# EAGLE design pcinterface-light (EAGLE 6.3)
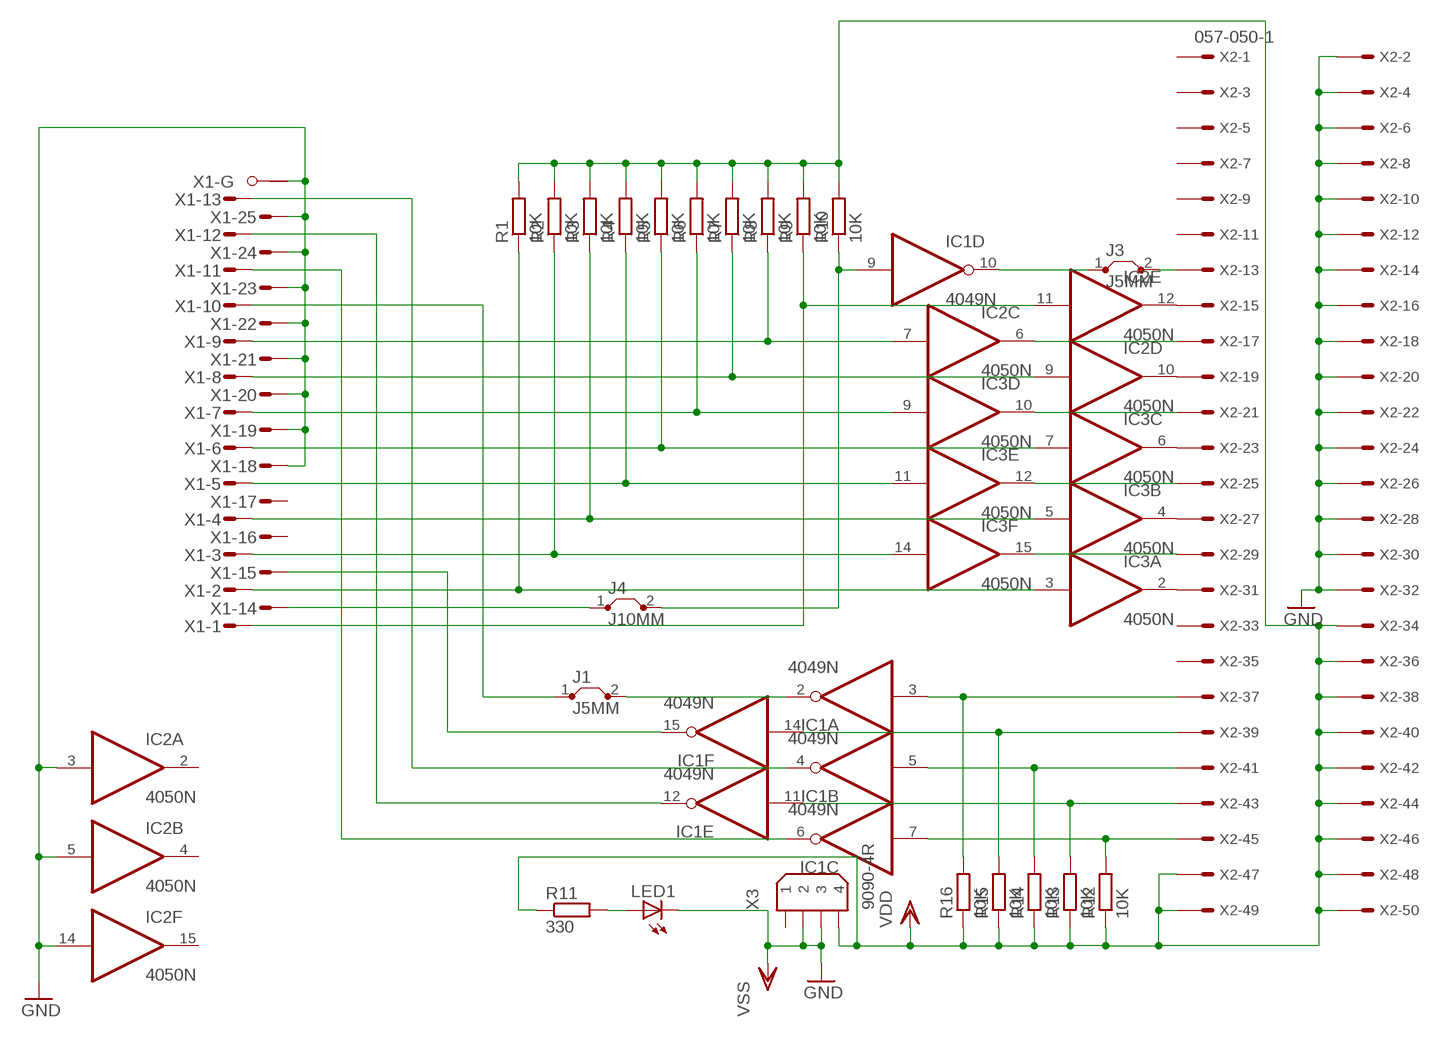
[diagram p0: schematic, sheet 1]

## Parts
IC1  4049N  [DIL16]
IC2  4050N  [DIL16]
IC3  4050N  [DIL16]
J1  J5MM  [05]
J3  J5MM  [05]
J4  J10MM  [10]
LED1  LED3MM  [LED3MM]
R1  10K  R-EU_0207/10  [0207/10]
R2  10K  R-EU_0207/10  [0207/10]
R3  10K  R-EU_0207/10  [0207/10]
R4  10K  R-EU_0207/10  [0207/10]
R5  10K  R-EU_0207/10  [0207/10]
R6  10K  R-EU_0207/10  [0207/10]
R7  10K  R-EU_0207/10  [0207/10]
R8  10K  R-EU_0207/10  [0207/10]
R9  10K  R-EU_0207/10  [0207/10]
R10  10K  R-EU_0207/10  [0207/10]
R11  330  R-EU_0207/10  [0207/10]
R12  10K  R-EU_0207/10  [0207/10]
R13  10K  R-EU_0207/10  [0207/10]
R14  10K  R-EU_0207/10  [0207/10]
R15  10K  R-EU_0207/10  [0207/10]
R16  10K  R-EU_0207/10  [0207/10]
X1  M25HPS  [M25HP]
X2  057-050-1  [057-050-1]
X3  9090-4R  [9090-4R]

## Nets
N$1: J4.1 X1.14(-14:M)
N$2: LED1.A R11.2
N$3: IC2.12(E:O) X2.15
N$4: IC2.6(C:O) X2.17
N$5: IC2.10(D:O) X2.19
N$6: IC3.10(D:O) X2.21
N$7: IC3.6(C:O) X2.23
N$8: IC3.12(E:O) X2.25
N$9: IC3.4(B:O) X2.27
N$10: IC3.15(F:O) X2.29
N$11: IC3.2(A:O) X2.31
N$12: IC1.9(D:I) J4.2 R10.1
N$13: IC2.11(E:I) R9.1 X1.1(-1:M)
N$14: IC2.7(C:I) R8.1 X1.9(-9:M)
N$15: IC2.9(D:I) R7.1 X1.8(-8:M)
N$16: IC3.9(D:I) R6.1 X1.7(-7:M)
N$17: IC3.7(C:I) R5.1 X1.6(-6:M)
N$18: IC3.11(E:I) R4.1 X1.5(-5:M)
N$19: IC3.5(B:I) R3.1 X1.4(-4:M)
N$20: IC3.14(F:I) R2.1 X1.3(-3:M)
N$21: IC3.3(A:I) R1.1 X1.2(-2:M)
N$22: IC1.7(C:I) R12.2 X2.45
N$23: IC1.11(E:I) R13.2 X2.43
N$24: IC1.5(B:I) R14.2 X2.41
N$25: IC1.14(F:I) R15.2 X2.39
N$26: IC1.3(A:I) R16.2 X2.37
N$28: IC1.6(C:O) X1.11(-11:M)
N$29: IC1.12(E:O) X1.12(-12:M)
N$30: IC1.4(B:O) X1.13(-13:M)
N$31: IC1.15(F:O) X1.15(-15:M)
N$32: J1.1 X1.10(-10:M)
N$34: IC1.2(A:O) J1.2
N$35: IC1.10(D:O) J3.1
N$36: J3.2 X2.13
VDD: R1.2 R2.2 R3.2 R4.2 R5.2 R6.2 R7.2 R8.2 R9.2 R10.2 R11.1 R12.1 R13.1 R14.1 R15.1 R16.1 X2.34 X2.36 X2.38 X2.40 X2.42 X2.44 X2.46 X2.47 X2.48 X2.49 X2.50 X3.4
VSS: IC2.3(A:I) IC2.5(B:I) IC2.14(F:I) LED1.K(C) X1.18(-18:M) X1.19(-19:M) X1.20(-20:M) X1.21(-21:M) X1.22(-22:M) X1.23(-23:M) X1.24(-24:M) X1.25(-25:M) X1.G1(-G:G1) X2.2 X2.4 X2.6 X2.8 X2.10 X2.12 X2.14 X2.16 X2.18 X2.20 X2.22 X2.24 X2.26 X2.28 X2.30 X2.32 X3.2 X3.3 ; supply symbol labelled GND
Unconnected: IC2.2(A:O) IC2.4(B:O) IC2.15(F:O) X1.16(-16:M) X1.17(-17:M) X1.G2(-G:G2) X2.1 X2.3 X2.5 X2.7 X2.9 X2.11 X2.33 X2.35 X3.1

## Power pins joined to a net without a drawn wire
VDD: IC1.1(P:VDD) IC2.1(P:VDD) IC3.1(P:VDD)
VSS: IC1.8(P:VSS) IC2.8(P:VSS) IC3.8(P:VSS)

## Library data of the parts
IC1 = 40xx:4049: Hex inverting BUFFER
IC2 IC3 = 40xx:4050: Hex non-inverting BUFFER
J1 J3 J4 = jumper:J: Bridge
LED1 = led:LED: LED OSRAM: - CHIPLED LG R971, LG N971, LY N971, LG Q971, LY Q971, LO R971, LY R971 LH N974, LH R974 LS Q976, LO Q976, LY Q976 LO Q996 - Hyper CHIPLED LW Q18S LB Q993, LB Q99A, LB R99A - SideLED LS A670, LO A670, LY A670, LG A670, LP A670 LB A673, LV A673, LT A673, LW A673 LH A674 LY A675 LS A676, LA A676, LO A676, LY A676, LW A676 LS A679, LY A679, LG A679 - Hyper Micro SIDELED® LS Y876, LA Y876, LO Y876, LY Y876 LT Y87S - SmartLED LW L88C, LW L88S LB L89C, LB L89S, LG L890 LS L89K, LO L89K, LY L89K LS L896, LA L896, LO L896, LY L896 - TOPLED LS T670, LO T670, LY T670, LG T670, LP T670 LSG T670, LSP T670, LSY T670, LOP T670, LYG T670 LG T671, LOG T671, LSG T671 LB T673, LV T673, LT T673, LW T673 LH T674 LS T676, LA T676, LO T676, LY T676, LB T676, LH T676, LSB T676, LW T676 LB T67C, LV T67C, LT T67C, LS T67K, LO T67K, LY T67K, LW E67C LS E67B, LA E67B, LO E67B, LY E67B, LB E67C, LV E67C, LT E67C LW T67C LS T679, LY T679, LG T679 LS T770, LO T770, LY T770, LG T770, LP T770 LB T773, LV T773, LT T773, LW T773 LH T774 LS E675, LA E675, LY E675, LS T675 LS T776, LA T776, LO T776, LY T776, LB T776 LHGB T686 LT T68C, LB T68C - Hyper Mini TOPLED® LB M676 - Mini TOPLED Santana® LG M470 LS M47K, LO M47K, LY M47K Source: http://www.osram.convergy.de LUXEON: - LUMILED® LXK2-PW12-R00, LXK2-PW12-S00, LXK2-PW14-U00, LXK2-PW14-V00 LXK2-PM12-R00, LXK2-PM12-S00, LXK2-PM14-U00 LXK2-PE12-Q00, LXK2-PE12-R00, LXK2-PE12-S00, LXK2-PE14-T00, LXK2-PE14-U00 LXK2-PB12-K00, LXK2-PB12-L00, LXK2-PB12-M00, LXK2-PB14-N00, LXK2-PB14-P00, LXK2-PB14-Q00 LXK2-PR12-L00, LXK2-PR12-M00, LXK2-PR14-Q00, LXK2-PR14-R00 LXK2-PD12-Q00, LXK2-PD12-R00, LXK2-PD12-S00 LXK2-PH12-R00, LXK2-PH12-S00 LXK2-PL12-P00, LXK2-PL12-Q00, LXK2-PL12-R00 Source: www.luxeon.com KINGBRIGHT: KA-3528ASYC Source: www.kingbright.com
R1-R16 = resistor:R-EU_: RESISTOR, European symbol
X1 = con-subd:M25HPS: SUB-D; OC_FARNELL: unknown; OC_NEWARK: unknown
X2 = con-panduit:057-050-: CONNECTOR 50-pin series 057 contact pc board low profile headers; OC_FARNELL: unknown; OC_NEWARK: unknown
X3 = con-thomas-betts:9090-4: Disk Drive Power four position Source: Thomas & Betts Electronic Interconnects Eiropean Edition 1998; OC_FARNELL: unknown; OC_NEWARK: unknown

## Board
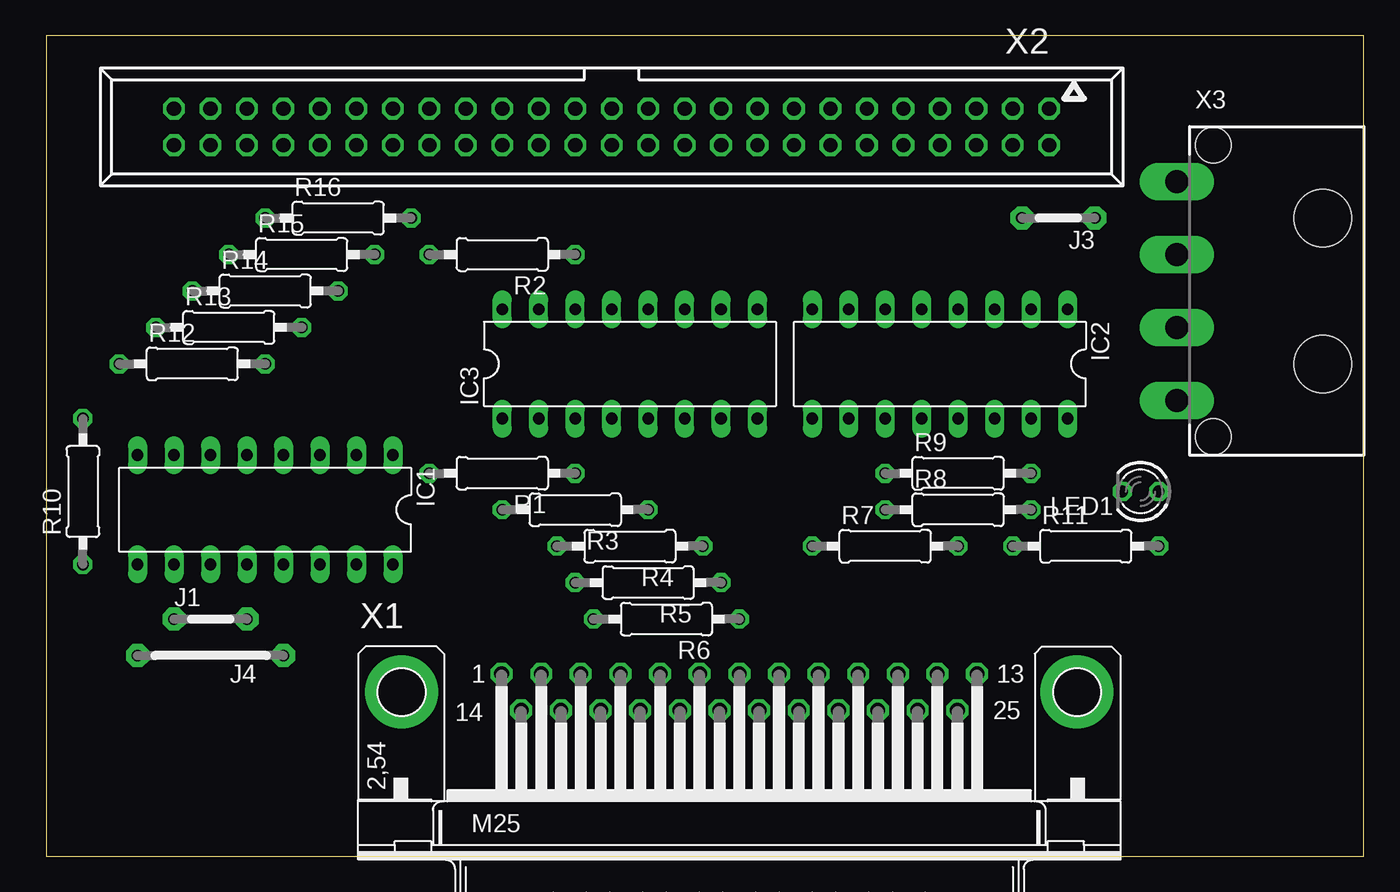
[diagram p1: board, top side]
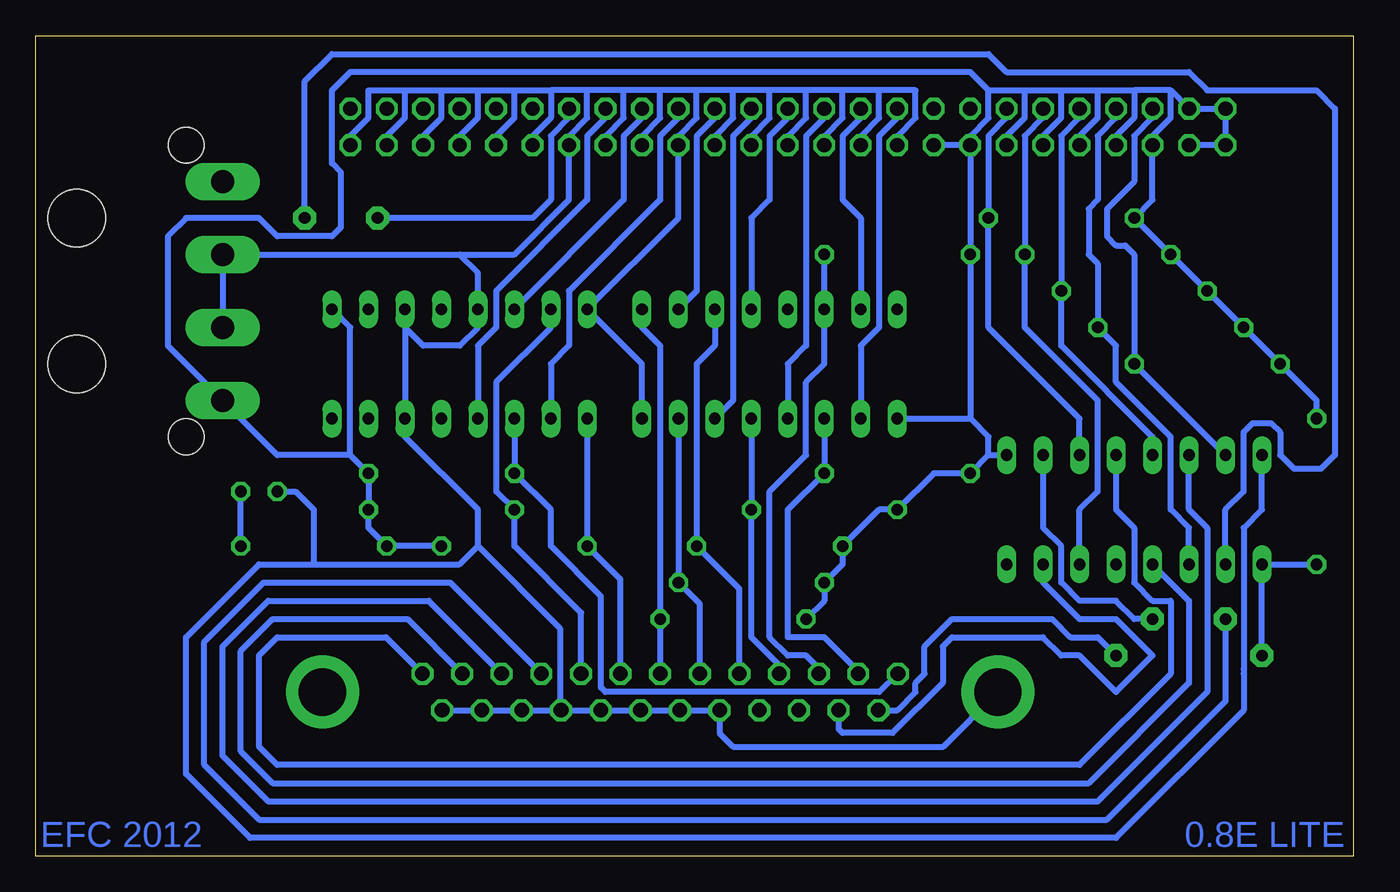
[diagram p2: board, bottom side, seen from below]

Size 91.75 x 57.14 mm. Coordinates in mm from the lower left corner, seen from the top.
Outline: 0,0 91.75,0 91.75,57.14 0,57.14 0,0
Copper layers (1*16): Top 0.035mm / dielectric 1.5mm / Bottom 0.035mm
Design rules "default": minimum track width 10mil, minimum drill 24mil, track to track 8mil, track to pad 8mil, pad to pad 8mil, via to via 8mil, smd to smd 8mil, copper to edge 40mil, drill to drill 8mil, minimum pad ring 10mil, minimum via ring 8mil, stop-mask expansion 4mil, vias tented up to drill 0mil, thermal gap 10mil

### Footprints (pad centres in the part's own frame; a part is rotated, then mirrored left to right if it is on the bottom)
DIL16 = drill 0.813 long: 1 -8.89,-3.81; 2 -6.35,-3.81; 3 -3.81,-3.81; 4 -1.27,-3.81; 5 1.27,-3.81; 6 3.81,-3.81; 7 6.35,-3.81; 8 8.89,-3.81; 9 8.89,3.81; 10 6.35,3.81; 11 3.81,3.81; 12 1.27,3.81; 13 -1.27,3.81; 14 -3.81,3.81; 15 -6.35,3.81; 16 -8.89,3.81
05 = drill 0.813 pad 1.6 octagon: 1 -2.54,0; 2 2.54,0
10 = drill 0.813 pad 1.6 octagon: 1 -5.08,0; 2 5.08,0
LED3MM = drill 0.813 octagon: A -1.27,0; K 1.27,0
0207/10 = drill 0.813 octagon: 1 -5.08,0; 2 5.08,0
M25HP = drill 1.016 octagon: 1 -16.561,1.27; 2 -13.792,1.27; 3 -11.049,1.27; 4 -8.28,1.27; 5 -5.512,1.27; 6 -2.769,1.27; 7 0,1.27; 8 2.769,1.27; 9 5.512,1.27; 10 8.28,1.27; 11 11.049,1.27; 12 13.792,1.27; 13 16.561,1.27; 14 -15.189,-1.27; 15 -12.421,-1.27; 16 -9.652,-1.27; 17 -6.909,-1.27; 18 -4.14,-1.27; 19 -1.372,-1.27; 20 1.372,-1.27; 21 4.14,-1.27; 22 6.909,-1.27; 23 9.652,-1.27; 24 12.421,-1.27; 25 15.189,-1.27 | drill 3.302 pad 5.08: G1 -23.52,0; G2 23.52,0
057-050-1 = drill 1 octagon: 1 -30.48,-1.27; 2 -30.48,1.27; 3 -27.94,-1.27; 4 -27.94,1.27; 5 -25.4,-1.27; 6 -25.4,1.27; 7 -22.86,-1.27; 8 -22.86,1.27; 9 -20.32,-1.27; 10 -20.32,1.27; 11 -17.78,-1.27; 12 -17.78,1.27; 13 -15.24,-1.27; 14 -15.24,1.27; 15 -12.7,-1.27; 16 -12.7,1.27; 17 -10.16,-1.27; 18 -10.16,1.27; 19 -7.62,-1.27; 20 -7.62,1.27; 21 -5.08,-1.27; 22 -5.08,1.27; 23 -2.54,-1.27; 24 -2.54,1.27; 25 0,-1.27; 26 0,1.27; 27 2.54,-1.27; 28 2.54,1.27; 29 5.08,-1.27; 30 5.08,1.27; 31 7.62,-1.27; 32 7.62,1.27; 33 10.16,-1.27; 34 10.16,1.27; 35 12.7,-1.27; 36 12.7,1.27; 37 15.24,-1.27; 38 15.24,1.27; 39 17.78,-1.27; 40 17.78,1.27; 41 20.32,-1.27; 42 20.32,1.27; 43 22.86,-1.27; 44 22.86,1.27; 45 25.4,-1.27; 46 25.4,1.27; 47 27.94,-1.27; 48 27.94,1.27; 49 30.48,-1.27; 50 30.48,1.27
9090-4R = drill 1.6 pad 2.6 long: 1 -7.62,-6.35; 2 -2.54,-6.35; 3 2.54,-6.35; 4 7.62,-6.35 | hole 4: -5.08,3.81; 5.08,3.81 | hole 2.5: -10.16,-3.81; 10.16,-3.81

### Placement (x,y rotation side)
IC1  15.24,24.13 180 top
IC2  62.23,34.29 180 top
IC3  40.64,34.29 0 top
J1  11.43,16.51 0 top
J3  70.48,44.45 180 top
J4  11.43,13.97 180 top
LED1  76.2,25.4 180 top
R1  31.75,26.67 180 top
R2  31.75,41.91 180 top
R3  36.83,24.13 180 top
R4  40.64,21.59 180 top
R5  41.91,19.05 180 top
R6  43.18,16.51 180 top
R7  58.42,21.59 0 top
R8  63.5,24.13 0 top
R9  63.5,26.67 0 top
R10  2.54,25.4 90 top
R11  72.39,21.59 0 top
R12  10.16,34.29 0 top
R13  12.7,36.83 0 top
R14  15.24,39.37 0 top
R15  17.78,41.91 0 top
R16  20.32,44.45 0 top
X1  48.26,11.43 0 top
X2  39.37,50.8 180 top
X3  85.09,39.37 270 top

### Tracks (layer width: path | path; a pad name or v marks a point on that pad's centre or on a via)
N$1
  Bottom 0.406: X1.14 31.75,10.16 30.48,11.43 30.48,12.06 29.84,12.7 29.84,14.61 27.94,16.51 20.95,16.51 19.69,15.24 17.78,15.24 J4.1
N$2
  Bottom 0.406: R11.2 LED1.A
N$3
  Bottom 0.406: X2.15 52.07,51.44 53.34,50.17 53.34,45.72 59.69,39.37 59.69,36.83 60.96,35.56 IC2.12
N$4
  Bottom 0.406: X2.17 49.53,51.44 50.8,50.17 50.8,45.72 IC2.6
N$5
  Bottom 0.406: X2.19 46.99,51.44 48.26,50.17 48.26,45.72 54.61,39.37 54.61,35.56 55.88,34.29 IC2.10
N$6
  Bottom 0.406: X2.21 44.45,51.44 45.72,50.17 45.72,39.37 IC3.10
N$7
  Bottom 0.406: X2.23 41.91,51.44 43.18,50.17 43.18,31.75 IC3.6
N$8
  Bottom 0.406: X2.25 39.37,51.44 40.64,50.17 40.64,45.72 41.91,44.45 IC3.12
N$9
  Bottom 0.406: X2.27 36.83,51.44 38.1,50.17 38.1,35.56 39.37,34.29 IC3.4
N$10
  Bottom 0.406: X2.29 34.29,51.44 35.56,50.17 35.56,45.72 34.29,44.45 IC3.15
N$11
  Bottom 0.406: X2.31 31.75,51.44 33.02,50.17 33.02,36.83 34.29,35.56 IC3.2
N$12
  Bottom 0.406: R10.1 IC1.9 J4.2
N$13
  Bottom 0.406: IC2.11 R9.1 55.88,24.13 55.88,21.59 52.39,18.1 52.39,11.75 52.07,11.43 33.02,11.43 31.75,12.7 X1.1
N$14
  Bottom 0.406: IC2.7 55.88,36.83 59.69,33.02 59.69,25.4 R8.1 58.42,21.59 53.77,16.94 X1.9
N$15
  Bottom 0.406: IC2.9 R7.1 51.03,19.28 X1.8
N$16
  Bottom 0.406: IC3.9 49.53,36.83 48.26,35.56 R6.1 X1.7
N$17
  Bottom 0.406: IC3.7 R5.1 45.49,17.55 X1.6
N$18
  Bottom 0.406: IC3.11 44.45,35.56 45.72,34.29 R4.1 42.75,18.62 X1.5
N$19
  Bottom 0.406: IC3.5 R3.1 41.91,15.24 39.98,13.31 X1.4
N$20
  Bottom 0.406: R2.1 IC3.14 36.83,34.29 38.1,33.02 38.1,27.94 40.64,25.4 40.64,15.24 39.37,13.97 38.1,13.97 37.21,13.08 X1.3
N$21
  Bottom 0.406: IC3.3 R1.1 39.37,24.13 39.37,15.24 36.83,15.24 34.47,12.88 X1.2
N$22
  Bottom 0.406: X2.45 13.97,51.44 15.24,50.17 15.24,46.99 17.15,45.08 17.15,43.18 16.51,42.55 15.87,42.55 15.24,41.91 R12.2 IC1.7
N$23
  Bottom 0.406: X2.43 16.51,51.44 17.78,50.17 17.78,45.72 18.41,45.08 18.41,41.91 17.78,41.28 R13.2 16.51,35.56 16.51,33.02 12.7,29.21 12.7,24.13 11.43,22.86 IC1.11
N$24
  Bottom 0.406: X2.41 19.05,51.44 20.32,50.17 R14.2 20.32,35.56 13.97,29.21 IC1.5
N$25
  Bottom 0.406: X2.39 21.59,51.44 22.86,50.17 R15.2 22.86,36.83 17.78,31.75 17.78,25.4 19.05,24.13 IC1.14
N$26
  Bottom 0.406: X2.37 24.13,51.44 25.4,50.17 R16.2 25.4,36.83 19.05,30.48 IC1.3
N$28
  Bottom 0.406: X1.11 64.39,17.78 75.56,17.78 78.74,14.61 78.74,6.98 75.56,3.81 17.78,3.81 10.16,11.43 10.16,22.86 11.43,24.13 IC1.6
N$29
  Bottom 0.406: X1.12 65.86,16.51 75.25,16.51 77.47,14.29 77.47,7.3 75.25,5.08 18.41,5.08 11.43,12.06 11.43,17.78 IC1.12
N$30
  Bottom 0.406: 64.82,12.75 X1.13 67.36,15.24 74.93,15.24 76.2,13.97 76.2,7.62 74.93,6.35 19.05,6.35 12.7,12.7 12.7,17.78 13.97,17.78 15.24,19.05 15.24,22.86 16.51,24.13 IC1.4
N$31
  Bottom 0.406: X1.15 35.84,8.85 35.56,8.57 32.07,8.57 28.58,12.06 28.58,14.61 27.94,15.24 21.59,15.24 20.32,13.97 19.05,13.97 16.51,11.43 13.97,13.97 16.51,16.51 19.05,16.51 21.59,19.05 IC1.15
N$32
  Bottom 0.406: X1.10 62.89,19.05 75.88,19.05 80.01,14.92 80.01,6.35 76.2,2.54 17.15,2.54 8.89,10.8 J1.1
N$34
  Bottom 0.406: IC1.2 21.59,22.86 20.32,21.59 20.32,19.05 19.05,17.78 16.51,17.78 15.24,16.51 J1.2
N$35
  Bottom 0.406: IC1.10 8.89,24.13 7.62,25.4 7.62,29.53 6.98,30.16 5.71,30.16 5.08,29.53 5.08,27.94 4.13,26.99 2.22,26.99 1.27,27.94 1.27,52.07 2.54,53.34 10.16,53.34 11.43,54.61 24.13,54.61 25.4,55.88 71.12,55.88 73.03,53.97 J3.1
N$36
  Bottom 0.406: X2.13 54.61,51.44 55.88,50.17 55.88,45.72 57.15,44.45 J3.2
VDD
  Bottom 0.406: 26.67,30.48 R2.2 X2.36 | 12.7,53.34 12.7,51.44 13.97,50.17 X2.46 13.97,45.72 R16.1 R15.1 R14.1 R13.1 R12.1 2.54,31.75 R10.2 | 12.7,53.34 15.24,53.34 | 15.24,53.34 15.24,51.44 16.51,50.17 X2.44 | X2.42 19.05,50.17 17.78,51.44 17.78,53.34 | 17.78,53.34 15.24,53.34 | X2.40 21.59,50.17 20.32,51.44 20.32,53.34 | 20.32,53.34 17.78,53.34 | X2.38 24.13,50.17 22.86,51.44 22.86,53.34 | 22.86,53.34 20.32,53.34 | X2.36 26.67,50.17 25.4,51.44 25.4,53.34 | 25.4,53.34 22.86,53.34 | X2.36 X2.34 | 12.7,53.34 X2.47 X2.49 X2.50 X2.48 | 25.4,53.34 26.67,54.61 69.85,54.61 71.12,53.34 71.12,48.26 70.48,47.62 70.48,43.81 71.12,43.18 74.93,43.18 76.2,44.45 81.28,44.45 82.55,43.18 82.55,35.56 X3.4 74.93,27.94 69.85,27.94 | IC3.1 26.67,30.48 | R6.2 36.83,17.78 R5.2 35.56,20.32 R4.2 33.02,24.13 R3.2 29.21,26.67 R1.2 25.4,27.94 | 69.85,27.94 69.85,36.83 IC2.1 | 25.4,27.94 25.4,29.21 26.67,30.48 | 25.4,27.94 IC1.1 | R7.2 R11.1 68.58,22.86 R8.2 R9.2 69.85,27.94
VSS
  Bottom 0.406: X2.12 57.15,50.17 55.88,51.44 55.88,53.34 | 53.34,53.34 53.34,51.44 54.61,50.17 X2.14 54.61,45.72 58.42,41.91 62.23,41.91 | 53.34,53.34 55.88,53.34 | X2.10 59.69,50.17 58.42,51.44 58.42,53.34 | 58.42,53.34 55.88,53.34 | X2.8 62.23,50.17 60.96,51.44 60.96,53.34 | 60.96,53.34 58.42,53.34 | X2.6 64.77,50.17 63.5,51.44 63.5,53.34 | 63.5,53.34 60.96,53.34 | X2.4 67.31,50.17 66.04,51.44 66.04,53.34 | 66.04,53.34 63.5,53.34 | X2.2 69.85,50.17 68.58,51.44 68.58,53.34 66.04,53.34 | X2.16 52.07,50.17 50.8,51.44 50.8,53.34 | 50.8,53.34 53.34,53.34 | X2.18 49.53,50.17 48.26,51.44 48.26,53.34 | 48.26,53.34 50.8,53.34 | 45.72,53.34 45.72,51.44 46.99,50.17 X2.20 46.99,44.45 IC2.8 49.53,34.29 IC3.8 | 45.72,53.34 48.26,53.34 | X2.22 44.45,50.17 43.18,51.44 43.18,53.34 | 43.18,53.34 45.72,53.34 | X2.24 41.91,50.17 40.64,51.44 40.64,53.34 | 40.64,53.34 43.18,53.34 | X2.26 39.37,50.17 38.1,51.44 38.1,53.34 | 38.1,53.34 40.64,53.34 | X2.28 36.83,50.17 35.56,51.44 35.56,53.34 | 35.56,53.34 38.1,53.34 | X2.30 34.29,50.17 33.02,51.44 33.02,53.34 | 33.02,53.34 35.56,53.34 | X2.32 31.75,50.17 30.48,51.44 30.48,53.34 33.02,53.34 | X3.3 X3.2 62.23,41.91 | X1.25 X1.24 X1.23 X1.22 | X1.22 X1.21 X1.20 X1.19 X1.18 44.12,8.56 43.18,7.62 28.55,7.62 X1.G1 | X1.22 55.25,10.24 55.25,15.88 60.96,21.59 | 60.96,21.59 60.96,24.13 66.04,29.21 IC2.14 IC2.3 66.04,36.83 64.77,35.56 62.23,35.56 60.96,36.83 IC2.5 60.96,40.64 62.23,41.91 | 72.39,20.32 76.2,20.32 81.28,15.24 81.28,5.71 76.84,1.27 16.51,1.27 7.62,10.16 7.62,12.7 7.62,13.02 7.62,22.86 6.35,24.13 IC1.8 | 72.39,20.32 62.23,20.32 60.96,21.59 | LED1.K 73.66,25.4 72.39,24.13 72.39,20.32

### Text on the board
Bottom: 0.8E LITE | EFC 2012